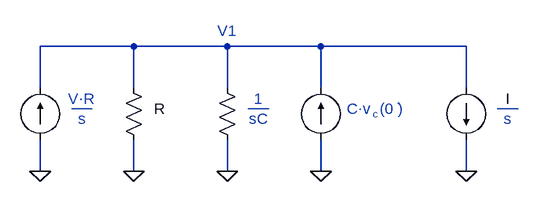
[diagram p0: schematic MathDescTransform.asc]
MathDescTransform.asc, the LTspice schematic file:
Version 4
SHEET 1 880 680
WIRE 64 64 -80 64
WIRE 208 64 64 64
WIRE 352 64 208 64
WIRE 576 64 352 64
WIRE -80 128 -80 64
WIRE 64 128 64 64
WIRE 208 128 208 64
WIRE 352 128 352 64
WIRE 576 128 576 64
WIRE -80 256 -80 208
WIRE 64 256 64 208
WIRE 208 256 208 208
WIRE 352 256 352 208
WIRE 576 256 576 208
FLAG -80 256 0
FLAG 208 256 0
FLAG 352 256 0
FLAG 576 256 0
FLAG 64 256 0
SYMBOL res 192 112 R0
WINDOW 0 36 40 Invisible 2
WINDOW 3 36 76 Invisible 2
SYMATTR InstName R2
SYMATTR Value 1/(sCx)
SYMBOL current 352 208 R180
WINDOW 0 24 80 Invisible 2
WINDOW 3 24 0 Invisible 2
SYMATTR InstName I1
SYMBOL current 576 128 R0
WINDOW 0 24 0 Invisible 2
WINDOW 3 64 32 Bottom 2
SYMATTR InstName I2
SYMBOL res 48 112 R0
WINDOW 0 36 40 Invisible 2
WINDOW 3 47 48 Left 2
SYMATTR InstName R1
SYMBOL current -80 208 R180
WINDOW 0 24 80 Invisible 2
WINDOW 3 24 0 Invisible 2
SYMATTR InstName I3
TEXT -16 160 Top 2 ;s
TEXT 256 160 Bottom 2 ;1
TEXT 256 160 Top 2 ;sC
TEXT 392 160 Left 2 ;C·v  (0 )
TEXT 640 160 Top 2 ;s
TEXT 472 152 Center 0 ;+
TEXT 432 168 Left 1 ;c
TEXT -16 160 Bottom 2 ;V·R
TEXT 208 56 Bottom 2 ;V1
LINE Normal 0 160 -32 160
LINE Normal 272 160 240 160
LINE Normal 656 160 624 160

The netlist it stands for:
* MathDescTransform.asc
R2 N001 0 1/(sCx)
I1 0 N001 I
I2 N001 0 I
R1 N001 0 R
I3 0 N001 I
* s
* 1
* sC
* C·v  (0 )
* s
* +
* c
* V·R
* V1
.backanno
.end